# EAGLE schematic LED (EAGLE 9.5.2)
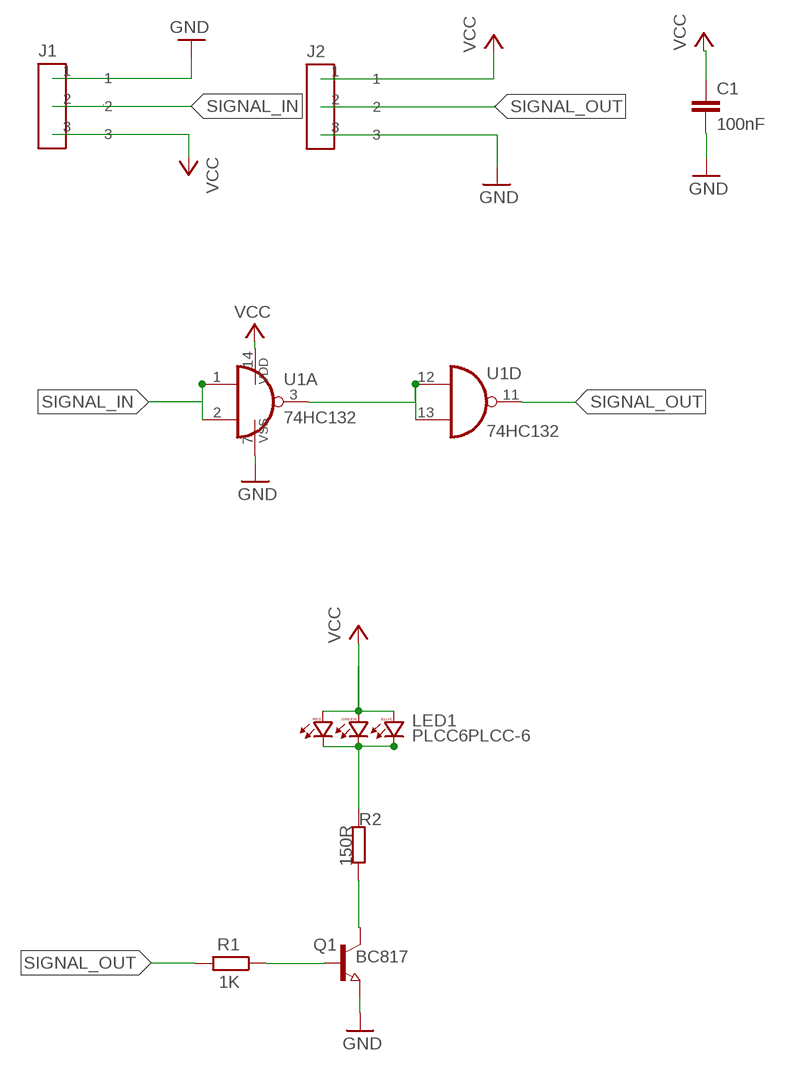
[diagram p0: schematic, sheet 1]

## Parts
C1  100nF  C-EUC0805  [C0805]
J1  CONECTOR_MACHO  [3CONECTOR]
J2  CONECTOR_FEMEA  [3CONECTOR]
LED1  PLCC6PLCC-6  [PLCC-6-LED]
Q1  BC817  NPN-TRANSISTOR_SOT23  [SOT23]
R1  1K  R-EU_R0805W  [R0805W]
R2  150R  R-EU_R0805W  [R0805W]
U1  74HC132  4011D  [SO14]

## Nets
GND: C1.2 J1.1 J2.3 Q1.2(E) U1.7(P:VSS)
N$1: U1.3(A:O) U1.12(D:I0) U1.13(D:I1)
N$2: Q1.1(B) R1.1
N$3: Q1.3(C) R2.1
N$5: LED1.CB(BC) LED1.CG(GC) LED1.CR(RC) R2.2
SIGNAL_IN: J1.2 U1.1(A:I0) U1.2(A:I1)
SIGNAL_OUT: J2.2 R1.2 U1.11(D:O)
VCC: C1.1 J1.3 J2.1 LED1.AB(BA) LED1.AG(GA) LED1.AR(RA) U1.14(P:VDD)
Unconnected: U1.4(B:O) U1.5(B:I0) U1.6(B:I1) U1.8(C:I0) U1.9(C:I1) U1.10(C:O)

## Library data of the parts
C1 = rcl:C-EU: CAPACITOR, European symbol; SPICEPREFIX: C
J1 = Eletroblocks Lib:CONECTOR_MACHO
J2 = Eletroblocks Lib:CONECTOR_FEMEA
LED1 = PLCC-6-LED:PLCC6: Full color Z-Power LED RGB P5-II Series Source: http://www.seoulsemicon.co.kr .. F50360.pdf
Q1 = semicon-smd-ipc:NPN-TRANSISTOR_: NPN TRANSISTOR
R1 R2 = rcl:R-EU_: RESISTOR, European symbol; SPICEPREFIX: R
U1 = 40xx:4011: Quad 2-input NAND